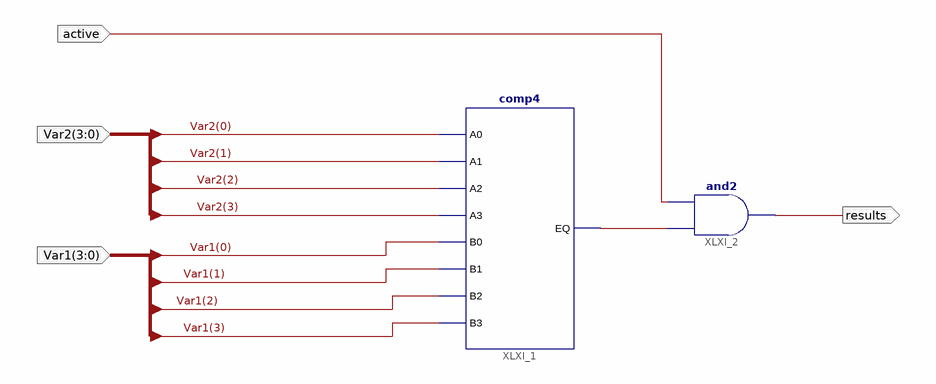
[diagram p0: schematic sheet 1]
// Xilinx ISE schematic Comparator.sch (spartan6) as structural Verilog: 2 symbols, 4 ports
module Comparator (
  input  active,
  input  [3:0] Var2,
  input  [3:0] Var1,
  output results
);

  wire XLXN_4;

  comp4 XLXI_1 (
    .A0(Var2[0]), .A1(Var2[1]), .A2(Var2[2]), .A3(Var2[3]), .B0(Var1[0]), .B1(Var1[1]), .B2(Var1[2]),
    .B3(Var1[3]), .EQ(XLXN_4));
  and XLXI_2 (results, XLXN_4, active);
endmodule
